# EAGLE design PowerMeter (EAGLE 9.3.0)
DATABASE: ../../../../digikeydb.txt
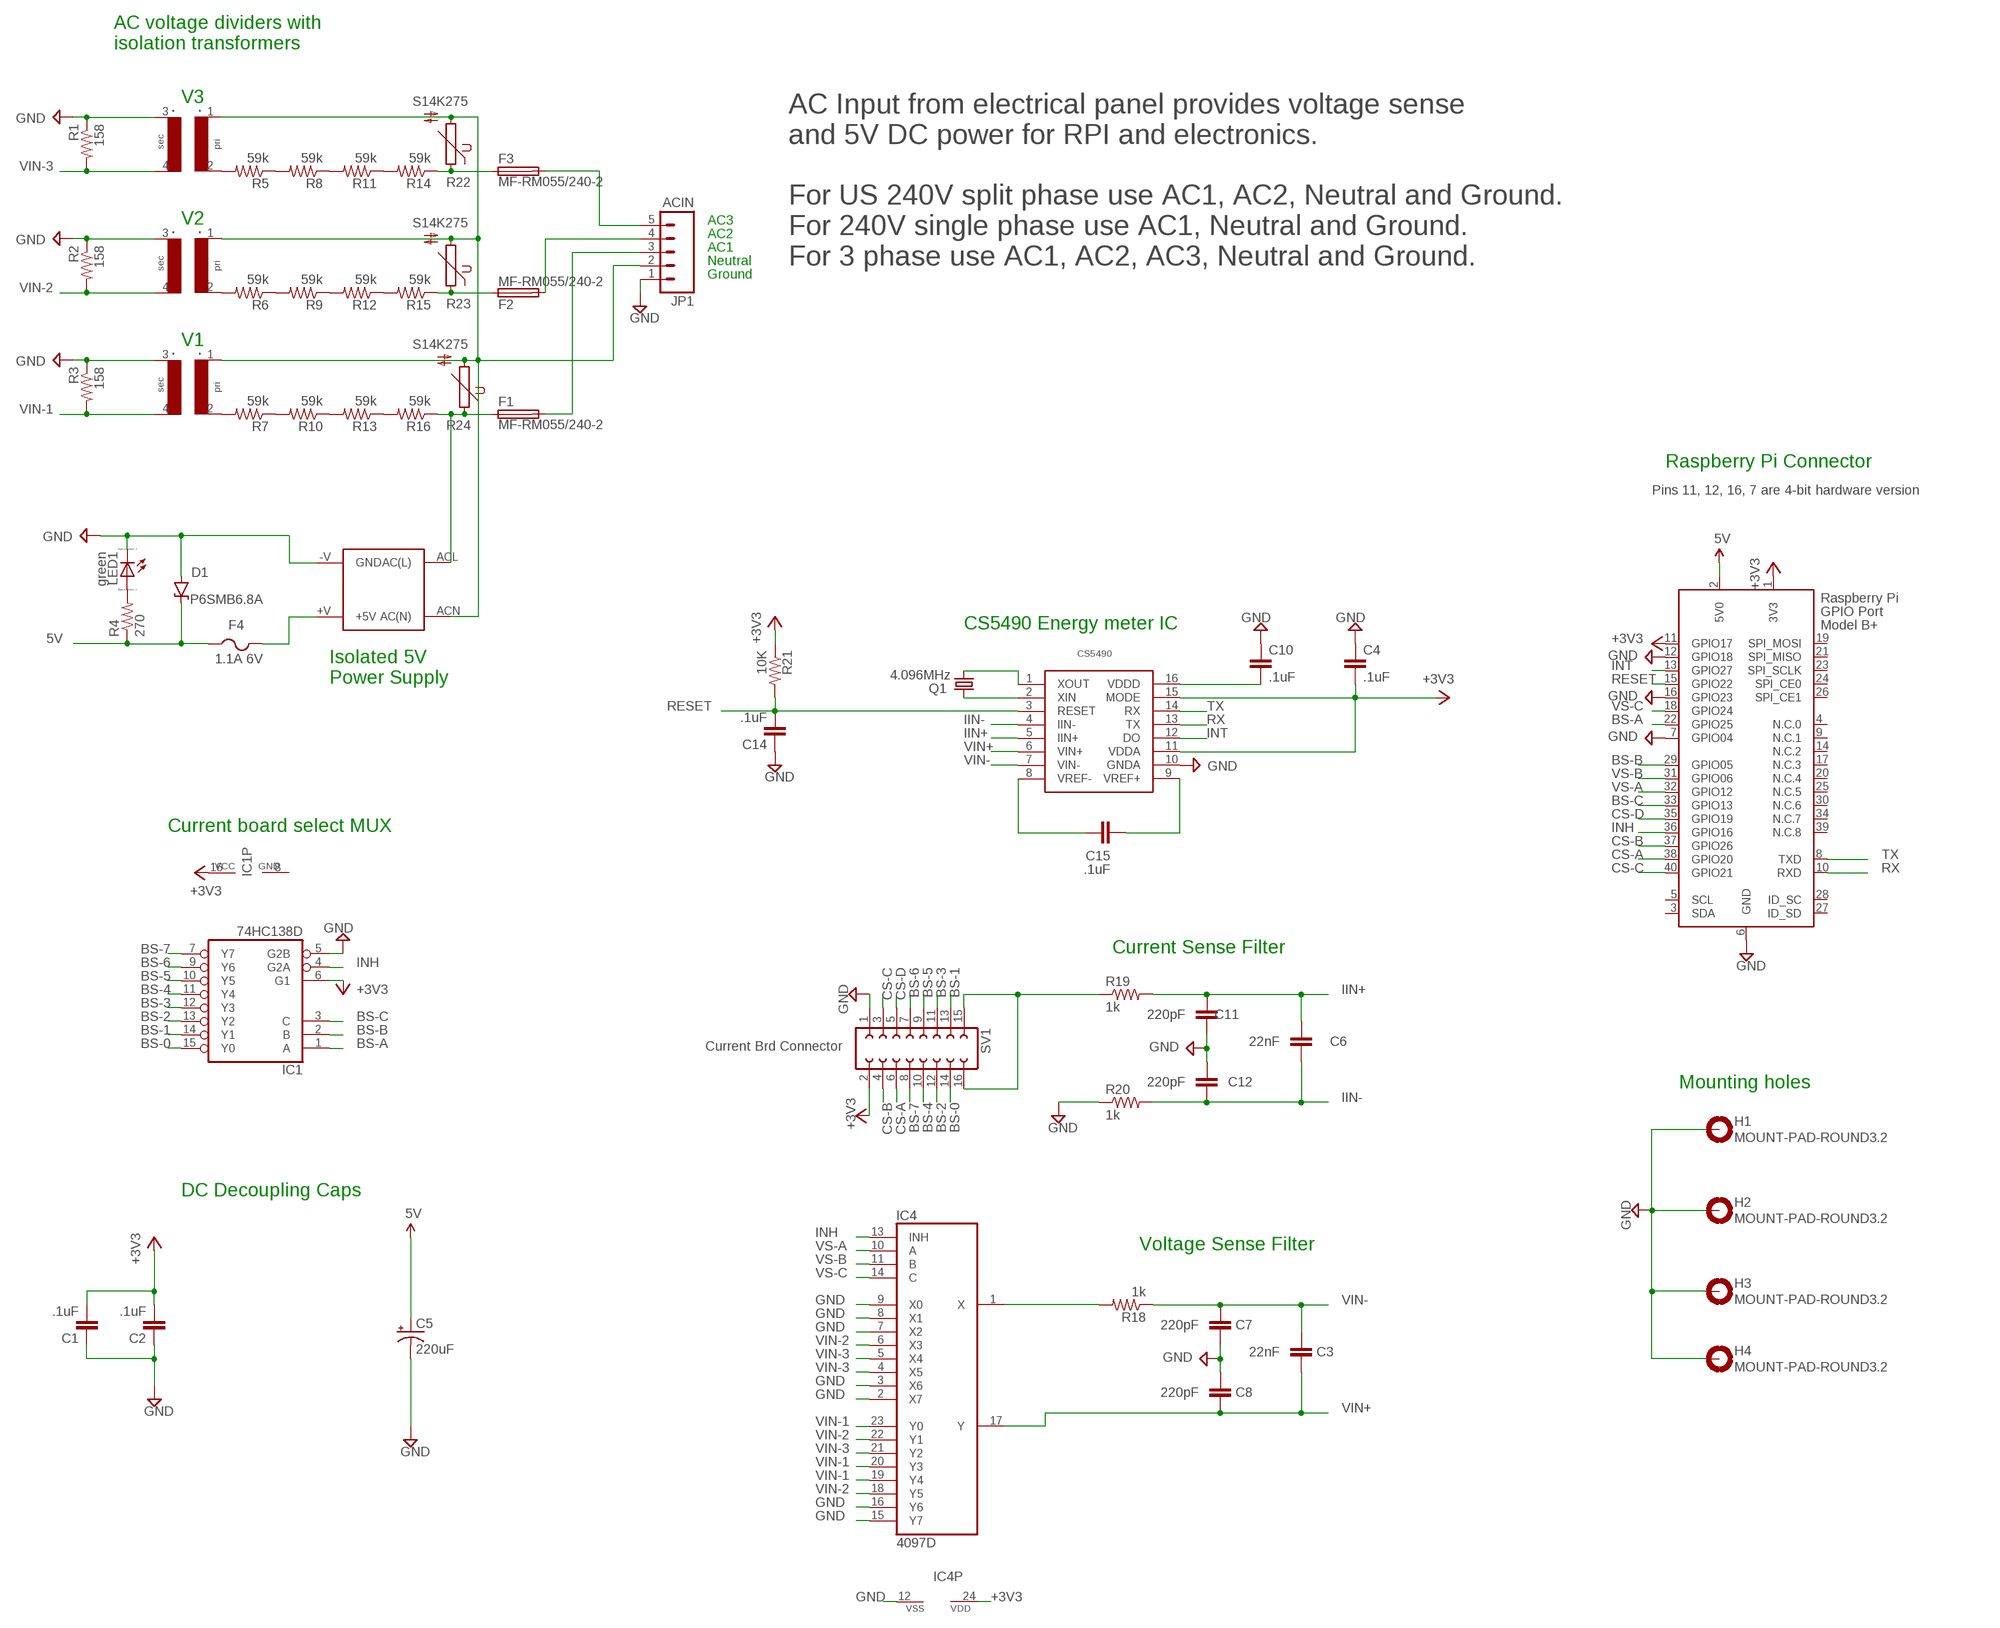
[diagram p0: schematic, sheet 1]

## Parts
C1  .1uF  C-EUC1206  [C1206]
C2  .1uF  C-EUC1206  [C1206]
C3  22nF  C-EUC1206  [C1206]
C4  .1uF  C-EUC1206  [C1206]
C5  220uF  CAP_POLD  [PANASONIC_D]
C6  22nF  C-EUC1206  [C1206]
C7  220pF  C-EUC1206  [C1206]
C8  220pF  C-EUC1206  [C1206]
C10  .1uF  C-EUC1206  [C1206]
C11  220pF  C-EUC1206  [C1206]
C12  220pF  C-EUC1206  [C1206]
C14  .1uF  C-EUC1206  [C1206]
C15  .1uF  C-EUC1206  [C1206]
CS5490  CS5490  [SOIC127P600X175-16N]
D1  P6SMB6.8A  DIODE-ZENER  [DO-214AA]
F1  MF-RM055/240-2  FUSETE5  [TE5]
F2  MF-RM055/240-2  FUSETE5  [TE5]
F3  MF-RM055/240-2  FUSETE5  [TE5]
F4  1.1A 6V  PTCFUSE-1812  [1812]
H1  MOUNT-PAD-ROUND3.2  [3,2-PAD]
H2  MOUNT-PAD-ROUND3.2  [3,2-PAD]
H3  MOUNT-PAD-ROUND3.2  [3,2-PAD]
H4  MOUNT-PAD-ROUND3.2  [3,2-PAD]
IC1  74HC138D  [SO16]
IC4  4097D  [SO24W]
JP1  ACIN  M05  [SCREWTERMINAL-5MM-5]
LED1  green  LED_E  [LED_1206]
Q1  4.096MHz  CRYSTALHC49UP  [HC49UP]
R1  158  R-US_R1206  [R1206]
R2  158  R-US_R1206  [R1206]
R3  158  R-US_R1206  [R1206]
R4  270  R-US_R1206  [R1206]
R5  59k  R-US_R1206  [R1206]
R6  59k  R-US_R1206  [R1206]
R7  59k  R-US_R1206  [R1206]
R8  59k  R-US_R1206  [R1206]
R9  59k  R-US_R1206  [R1206]
R10  59k  R-US_R1206  [R1206]
R11  59k  R-US_R1206  [R1206]
R12  59k  R-US_R1206  [R1206]
R13  59k  R-US_R1206  [R1206]
R14  59k  R-US_R1206  [R1206]
R15  59k  R-US_R1206  [R1206]
R16  59k  R-US_R1206  [R1206]
R18  1k  R-US_R1206  [R1206]
R19  1k  R-US_R1206  [R1206]
R20  1k  R-US_R1206  [R1206]
R21  10K  R-US_R1206  [R1206]
R22  S14K275  [S14K275]
R23  S14K275  [S14K275]
R24  S14K275  [S14K275]
SV1  Current Brd Connector  FE08-2  [FE08-2]
T1  TV16E  [TV16E]
T2  TV16E  [TV16E]
T3  TV16E  [TV16E]
U$1  IRM-10  [IRM-10]
X1  RASPI_BOARD_B+_E4  [RASPI_BOARD_B+_EDGES_4DRILL]

## Nets
5V: C5.+ D1.C F4.1 R4.1 X1.2(5V0)
+3V3: C1.2 C2.2 C4.2 CS5490.11(VDDA) CS5490.15(MODE) IC1.6(G1) IC1.16(VCC) IC4.24(VDD) R21.1 SV1.2 X1.1(3V3) X1.11(GPIO17)
+5V: F4.2 U$1.+V(+5V)
AC(L) [ac line]: F1.1 R16.1 R24.1 U$1.ACL(AC(L))
AC(N) [ac line]: JP1.2 R22.2 R23.2 R24.2 T1.1 T2.1 T3.1 U$1.ACN(AC(N))
BS-0: IC1.15(Y0) SV1.14
BS-1: IC1.14(Y1) SV1.13
BS-2: IC1.13(Y2) SV1.12
BS-3: IC1.12(Y3) SV1.11
BS-4: IC1.11(Y4) SV1.10
BS-5: IC1.10(Y5) SV1.9
BS-6: IC1.9(Y6) SV1.7
BS-7: IC1.7(Y7) SV1.8
BS-A: IC1.1(A) X1.22(GPIO25)
BS-B: IC1.2(B) X1.29(GPIO05)
BS-C: IC1.3(C) X1.33(GPIO13)
CS-A: SV1.6 X1.38(GPIO20)
CS-B: SV1.4 X1.37(GPIO26)
CS-C: SV1.3 X1.40(GPIO21)
CS-D: SV1.5 X1.35(GPIO19)
GND: C1.1 C2.1 C4.1 C5.- C7.1 C8.2 C10.1 C11.1 C12.2 C14.1 CS5490.10(GNDA) D1.A H1.B3,2(MOUNT) H2.B3,2(MOUNT) H3.B3,2(MOUNT) H4.B3,2(MOUNT) IC1.5(G2B) IC4.2(X7) IC4.3(X6) IC4.7(X2) IC4.8(X1) IC4.9(X0) IC4.12(VSS) IC4.15(Y7) IC4.16(Y6) JP1.1 LED1.C R1.1 R2.1 R3.1 R20.1 SV1.1 T1.3 T2.3 T3.3 U$1.-V(GND) X1.6(GND) X1.7(GPIO04) X1.12(GPIO18) X1.16(GPIO23)
IIN+: C6.2 C11.2 CS5490.5(IIN+) R19.2
IIN-: C6.1 C12.1 CS5490.4(IIN-) R20.2
INH: IC1.4(G2A) IC4.13(INH) X1.36(GPIO16)
INT: CS5490.12(DO) X1.13(GPIO27)
N$1: CS5490.2(XIN) Q1.1
N$2 [ac line]: F2.1 R15.1 R23.1
N$3 [ac line]: R5.1 R8.2
N$4 [ac line]: R8.1 R11.2
N$5 [ac line]: F1.2 JP1.3
N$6 [ac line]: R9.1 R12.2
N$7: LED1.A R4.2
N$8: IC4.1(X) R18.2
N$9 [ac line]: F3.2 JP1.5
N$10 [ac line]: R13.1 R16.2
N$11 [ac line]: R7.2 T3.2
N$12: CS5490.1(XOUT) Q1.2
N$13 [ac line]: R7.1 R10.2
N$14 [ac line]: R10.1 R13.2
N$15 [ac line]: R6.2 T2.2
N$16 [ac line]: R6.1 R9.2
N$17: C10.2 CS5490.16(VDDD)
N$18 [ac line]: R12.1 R15.2
N$19 [ac line]: R5.2 T1.2
N$20 [ac line]: R11.1 R14.2
N$22 [ac line]: F3.1 R14.1 R22.1
N$23: R19.1 SV1.15 SV1.16
N$24: C15.1 CS5490.8(VREF-)
N$25: C15.2 CS5490.9(VREF+)
N$38 [ac line]: F2.2 JP1.4
RESET: C14.2 CS5490.3(RESET) R21.2 X1.15(GPIO22)
RX: CS5490.13(TX) X1.10(RXD)
TX: CS5490.14(RX) X1.8(TXD)
VIN+: C3.1 C8.1 CS5490.6(VIN+) IC4.17(Y)
VIN-: C3.2 C7.2 CS5490.7(VIN-) R18.1
VIN-1: IC4.19(Y4) IC4.20(Y3) IC4.23(Y0) R3.2 T3.4
VIN-2: IC4.6(X3) IC4.18(Y5) IC4.22(Y1) R2.2 T2.4
VIN-3: IC4.4(X5) IC4.5(X4) IC4.21(Y2) R1.2 T1.4
VS-A: IC4.10(A) X1.32(GPIO12)
VS-B: IC4.11(B) X1.31(GPIO06)
VS-C: IC4.14(C) X1.18(GPIO24)
Unconnected: X1.3(SDA) X1.4(N.C.0) X1.5(SCL) X1.9(N.C.1) X1.14(N.C.2) X1.17(N.C.3) X1.19(SPI_MOSI) X1.20(N.C.4) X1.21(SPI_MISO) X1.23(SPI_SCLK) X1.24(SPI_CE0) X1.25(N.C.5) X1.26(SPI_CE1) X1.27(ID_SD) X1.28(ID_SC) X1.30(N.C.6) X1.34(N.C.7) X1.39(N.C.8)

## Notes on the sheet
- AC voltage dividers with
  isolation transformers
- V3
- V2 | AC3
- AC2
- AC1
- Neutral
- AC Input from electrical panel provides voltage sense 
  and 5V DC power for RPI and electronics.
  
  For US 240V split phase use AC1, AC2, Neutral and Ground.
  For 240V single phase use AC1, Neutral and Ground.
  For 3 phase use AC1, AC2, AC3, Neutral and Ground.
- Ground
- V1
- Raspberry Pi Connector
- Pins 11, 12, 16, 7 are 4-bit hardware version
- CS5490 Energy meter IC
- Isolated 5V
  Power Supply
- Current board select MUX
- Current Sense Filter
- Mounting holes
- DC Decoupling Caps
- Voltage Sense Filter

## Power pins joined to a net without a drawn wire
GND: IC1.8(GND)

## Library data of the parts
C1 C2 C4 C10 C14 C15 = rcl:C-EU: CAPACITOR, European symbol; PARTNO: C1206C104K5RAC7867
C3 C6-C8 C11 C12 = rcl:C-EU: CAPACITOR, European symbol; PARTNO: C1206C221J5GACTU
C5 = SparkFun-Capacitors:CAP_POL: Capacitor Polarized These are standard SMD and PTH capacitors. Normally 10uF, 47uF, and 100uF in electrolytic and tantalum varieties. Always verify the external diameter of the through hole cap, it varies with capacity, voltage, and manufacturer. The EIA devices should be standard.; PARTNO: ESH227M016AE3AA
CS5490 = Cirrus_Logic_By_element14_Batch_1:CS5490
D1 = SparkFun-DiscreteSemi:DIODE-ZENER: Zener Diode Production Part - 8199 3.4V Zener Voltage; PARTNO: P6KE6.8A
F1-F3 = fuse:FUSE: Fuse; OC_FARNELL: unknown; OC_NEWARK: unknown; PARTNO: MF-RM055/240-2
F4 = adafruit:PTCFUSE: PTC fuses, resettable thermistors; PARTNO: 0ZCC0110AF2C
H1-H4 = holes:MOUNT-PAD-ROUND: MOUNTING PAD, round; BOM: EXCLUDE
IC1 = 74xx-eu:74*138: 3-line to 8-line DECODER/DEMULTIPLEXER; PARTNO: SN74HC138NSR
IC4 = 40xx:4097: Dual 8-channel ANALOG MULTIPLEXER
JP1 = SparkFun-Connectors:M05: Header 5 Standard 5-pin 0.1" header. Use with straight break away headers (SKU : PRT-00116), right angle break away headers (PRT-00553), swiss pins (PRT-00743), machine pins (PRT-00117), and female headers (PRT-00115). Molex polarized connector foot print use with SKU : PRT-08230 with associated crimp pins and housings.; PARTNO: 1935190
LED1 = eagle-ltspice:LED_E: LED Source: http://www.osram.convergy.de Source: www.luxeon.com Source: www.kingbright.com; PARTNO: LTST-C150GKT; SPICEMODEL: NONE; SPICEPREFIX: D; SPICETYPE: diode
Q1 = adafruit:CRYSTAL: CRYSTAL; OC_FARNELL: unknown; OC_NEWARK: unknown; PARTNO: 9B-4.096MBBK-B
R1-R3 = resistor:R-US_: RESISTOR, American symbol; PARTNO: RC1206FR-07158RL
R4 = resistor:R-US_: RESISTOR, American symbol; PARTNO: RC1206FR-07270RL
R5-R16 R18-R20 = resistor:R-US_: RESISTOR, American symbol; PARTNO: RC1206FR-071KL
R21 = resistor:R-US_: RESISTOR, American symbol; PARTNO: RC1206FR-0710KL
R22-R24 = varistor:S14K275: VARISTOR
SV1 = con-lsta:FE08-2: FEMALE HEADER; OC_FARNELL: unknown; OC_NEWARK: unknown; PARTNO: PPTC082LFBN-RC
T1-T3 = CraigJensen:TV16E: YHDC TV16E Transformer
U$1 = CraigJensen:IRM-10
X1 = raspberrypi_bastelstube_v13:RASPI_BOARD_B+: Raspberry Pi GPIO connector with markings for the outer dimensions of the Raspberry Pi board model B+ with different sets of drill holes or mounting pads; PARTNO: M20-9762046

## Net classes
1 ac line: width 0.4 mm, clearance 1.2 mm

## Board
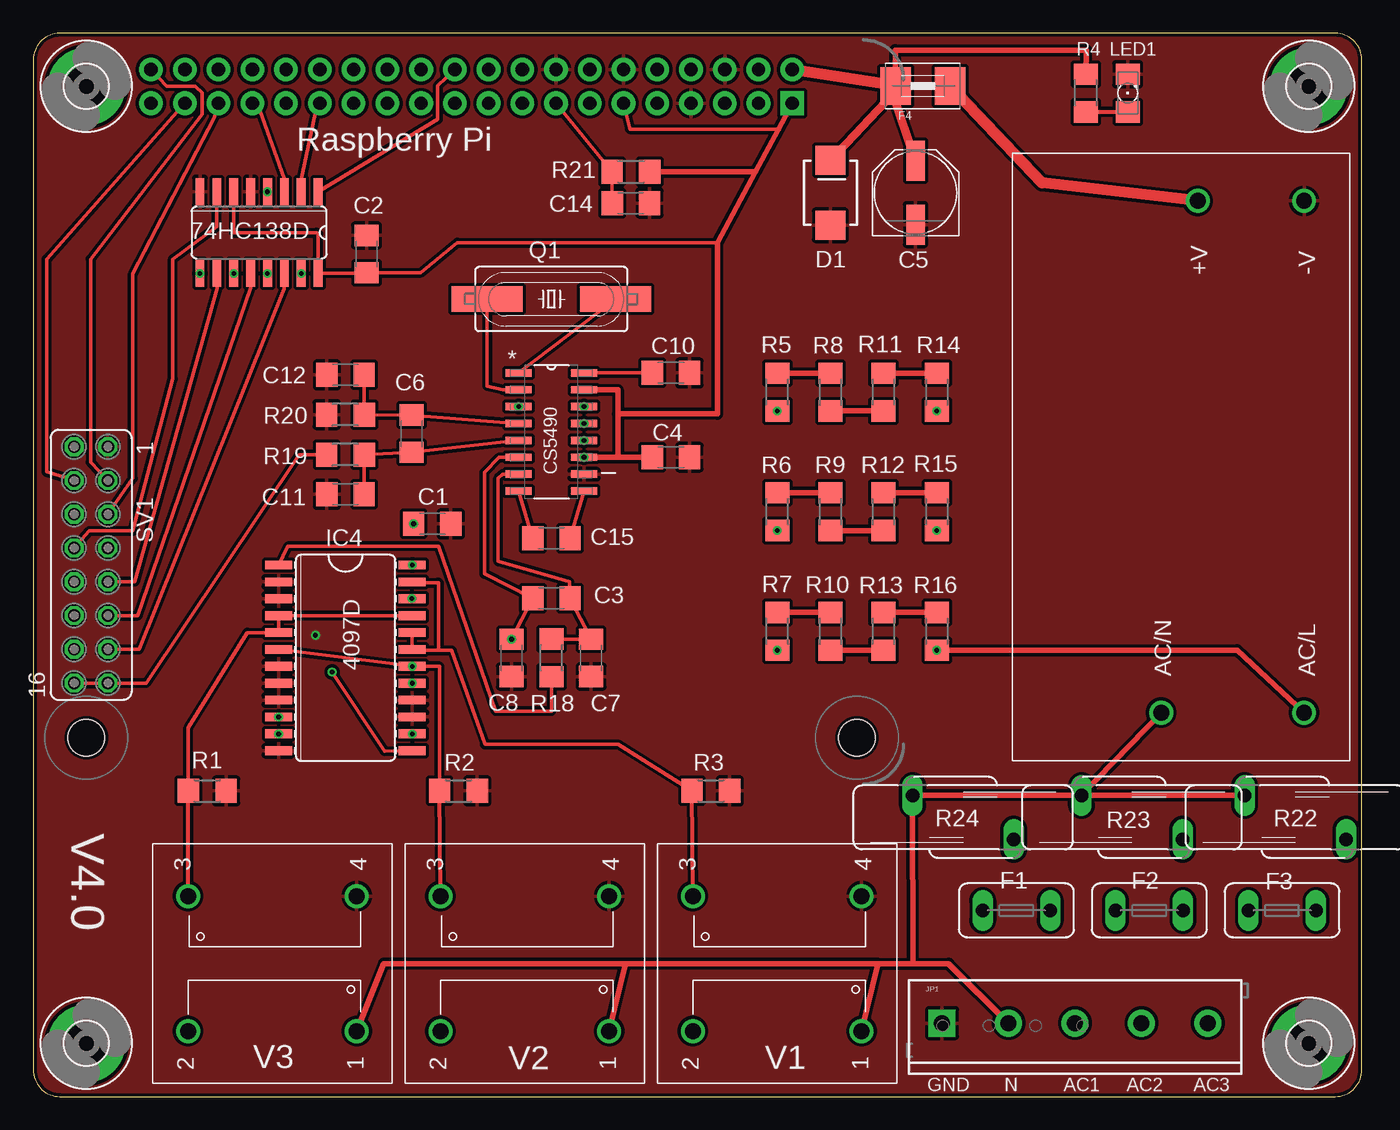
[diagram p1: board, top side]
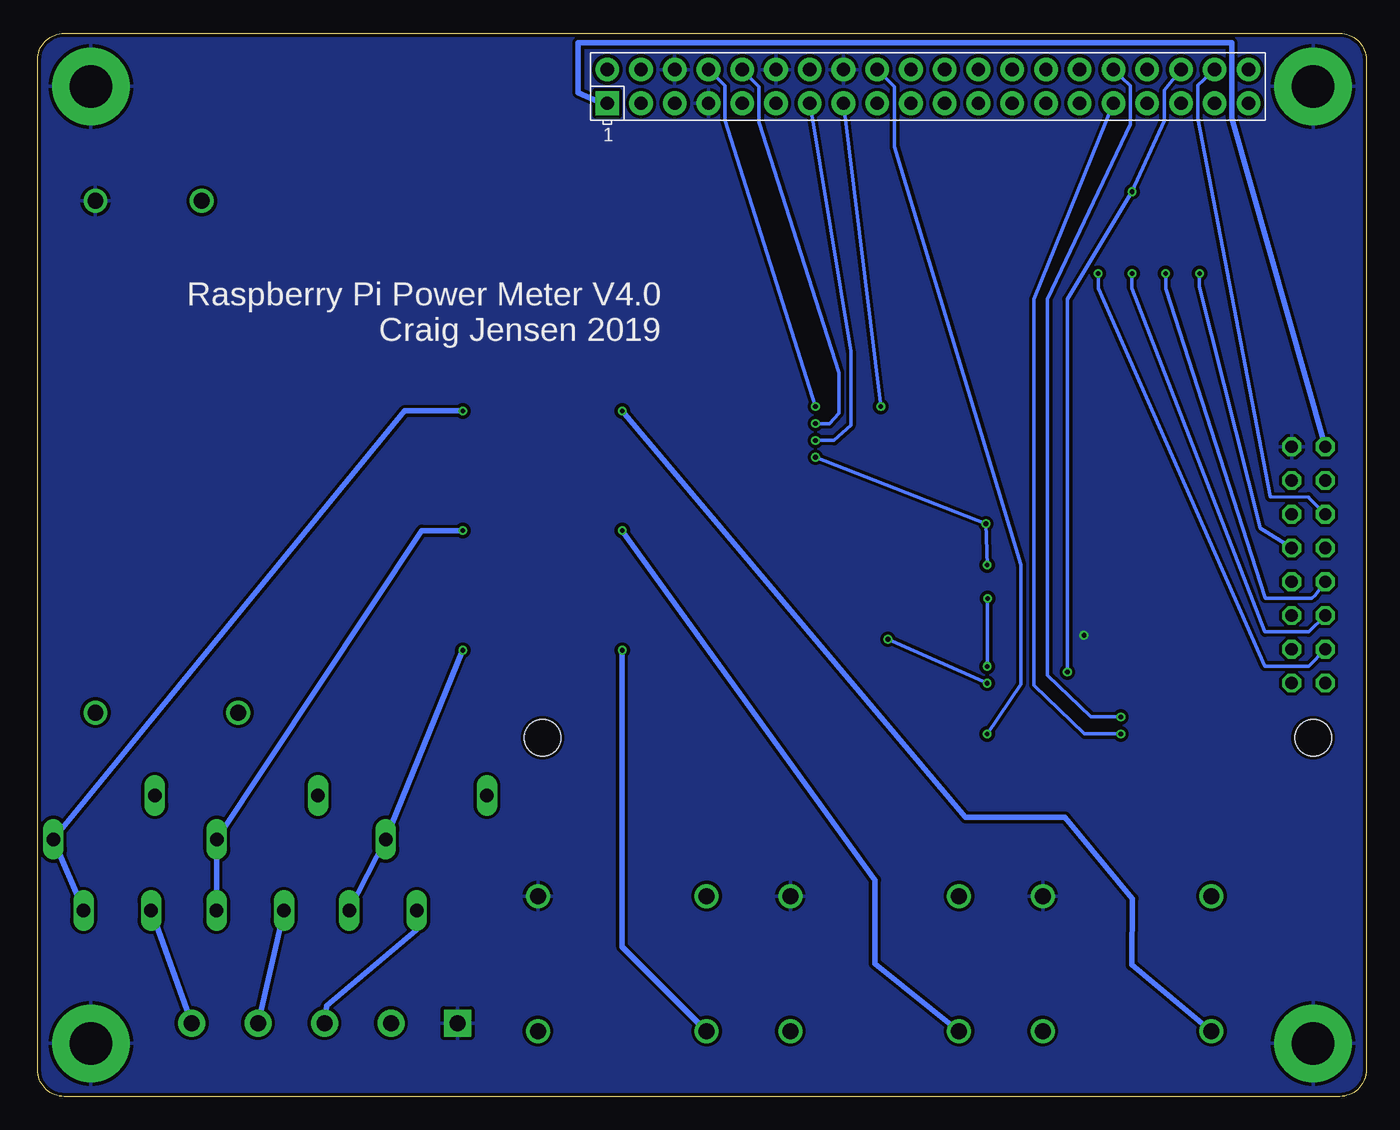
[diagram p2: board, bottom side, seen from below]

Size 100 x 80 mm. Coordinates in mm from the lower left corner, seen from the top.
Outline: 98,80 2,80 arc90 0,78 0,2 arc90 2,0 98,0 arc90 100,2 100,78 arc90 98,80
Copper layers (1*16): Top 0.035mm / dielectric 1.5mm / Bottom 0.035mm
Design rules "Elecrow_2-layer_eagle_rule": minimum track width 6mil, minimum drill 12mil, track to track 6mil, track to pad 6mil, pad to pad 6mil, via to via 6mil, smd to smd 0mil, copper to edge 10mil, drill to drill 10mil, minimum pad ring 10mil, minimum via ring 6mil, stop-mask expansion 2mil, vias tented up to drill 100mil, thermal gap 10mil

### Footprints (pad centres in the part's own frame; a part is rotated, then mirrored left to right if it is on the bottom)
C1206 = smd 1.6 x 1.8: 1 -1.4,0; 2 1.4,0
PANASONIC_D = smd 3 x 1.4: + 2.4,0; - -2.4,0
SOIC127P600X175-16N = smd 1.981 x 0.559: 1 -2.464,4.445; 2 -2.464,3.175; 3 -2.464,1.905; 4 -2.464,0.635; 5 -2.464,-0.635; 6 -2.464,-1.905; 7 -2.464,-3.175; 8 -2.464,-4.445; 9 2.464,-4.445; 10 2.464,-3.175; 11 2.464,-1.905; 12 2.464,-0.635; 13 2.464,0.635; 14 2.464,1.905; 15 2.464,3.175; 16 2.464,4.445
DO-214AA = smd 2.16 x 2.26: A -2.45,0; C 2.45,0
TE5 = drill 1.016 long: 1 -2.54,0; 2 2.54,0
1812 = smd 2.286 x 2.794: 1 -2.046,0; 2 2.046,0
3,2-PAD = drill 3.2 pad 5.842: B3,2 0,0
SO16 = smd 0.66 x 2.032: 1 -4.445,-3.073; 2 -3.175,-3.073; 3 -1.905,-3.073; 4 -0.635,-3.073; 5 0.635,-3.073; 6 1.905,-3.073; 7 3.175,-3.073; 8 4.445,-3.073; 9 4.445,3.073; 10 3.175,3.073; 11 1.905,3.073; 12 0.635,3.073; 13 -0.635,3.073; 14 -1.905,3.073; 15 -3.175,3.073; 16 -4.445,3.073
SO24W = smd 0.66 x 2.032: 1 -6.985,-5.029; 2 -5.715,-5.029; 3 -4.445,-5.029; 4 -3.175,-5.029; 5 -1.905,-5.029; 6 -0.635,-5.029; 7 0.635,-5.029; 8 1.905,-5.029; 9 3.175,-5.029; 10 4.445,-5.029; 11 5.715,-5.029; 12 6.985,-5.029; 13 6.985,5.029; 14 5.715,5.029; 15 4.445,5.029; 16 3.175,5.029; 17 1.905,5.029; 18 0.635,5.029; 19 -0.635,5.029; 20 -1.905,5.029; 21 -3.175,5.029; 22 -4.445,5.029; 23 -5.715,5.029; 24 -6.985,5.029
SCREWTERMINAL-5MM-5 = drill 1.2 pad 2.032 square: 1 2.53,4.46 | drill 1.2 pad 2.032: 2 7.53,4.46; 3 12.53,4.46; 4 17.53,4.46; 5 22.53,4.46
LED_1206 = smd 1.6 x 1.803: A -1.422,0; C 1.422,0
HC49UP = smd 5.334 x 1.93: 1 -4.826,0; 2 4.826,0
R1206 = smd 1.6 x 1.803: 1 -1.422,0; 2 1.422,0
S14K275 = drill 1.016 long: 1 -1.651,-3.81; 2 1.651,3.81
FE08-2 = drill 0.914 octagon: 1 -8.89,1.27; 2 -8.89,-1.27; 3 -6.35,1.27; 4 -6.35,-1.27; 5 -3.81,1.27; 6 -3.81,-1.27; 7 -1.27,1.27; 8 -1.27,-1.27; 9 1.27,1.27; 10 1.27,-1.27; 11 3.81,1.27; 12 3.81,-1.27; 13 6.35,1.27; 14 6.35,-1.27; 15 8.89,1.27; 16 8.89,-1.27
TV16E = drill 1.2: 1 -5.08,-6.35; 2 -5.08,6.35; 3 5.08,-6.35; 4 5.08,6.35
IRM-10 = drill 1.2: +V 19.25,-1.25; -V 19.25,-9.25; ACL -19.25,-9.25; ACN -19.25,1.5
RASPI_BOARD_B+_EDGES_4DRILL = drill 1 pad 1.778 square: 1 8.37,51.23 | drill 1 pad 1.778: 2 8.37,53.77; 3 10.91,51.23; 4 10.91,53.77; 5 13.45,51.23; 6 13.45,53.77; 7 15.99,51.23; 8 15.99,53.77; 9 18.53,51.23; 10 18.53,53.77; 11 21.07,51.23; 12 21.07,53.77; 13 23.61,51.23; 14 23.61,53.77; 15 26.15,51.23; 16 26.15,53.77; 17 28.69,51.23; 18 28.69,53.77; 19 31.23,51.23; 20 31.23,53.77; 21 33.77,51.23; 22 33.77,53.77; 23 36.31,51.23; 24 36.31,53.77; 25 38.85,51.23; 26 38.85,53.77; 27 41.39,51.23; 28 41.39,53.77; 29 43.93,51.23; 30 43.93,53.77; 31 46.47,51.23; 32 46.47,53.77; 33 49.01,51.23; 34 49.01,53.77; 35 51.55,51.23; 36 51.55,53.77; 37 54.09,51.23; 38 54.09,53.77; 39 56.63,51.23; 40 56.63,53.77 | hole 2.75: 61.5,3.5; 3.5,3.5

### Placement (x,y rotation side)
C1  30.03,43.09 180 top
C2  25.08,63.38 270 top
C3  39,37.5 0 top
C4  48,48.1 180 top
C5  66.41,68 90 top
C6  28.47,49.87 270 top
C7  42,33 90 top
C8  36,33 270 top
C10  48,54.44 180 top
C11  23.5,45.3 0 top
C12  23.5,54.3 180 top
C14  44.98,67.22 180 top
C15  39,42 0 top
CS5490  39,50 0 top
D1  60,68 90 top
F1  74,14 180 top
F2  84,14 180 top
F3  94,14 180 top
F4  66.96,76.03 0 top
H1  96,76 0 top
H2  96,4 0 top
H3  4,4 0 top
H4  4,76 0 top
IC1  17,65 180 top
IC4  23.5,33 270 top
JP1  65.88,1.06 0 top
LED1  82.38,75.5 90 top
Q1  39,60 0 top
R1  13.1,23 180 top
R2  32,23 180 top
R3  51,23 180 top
R4  79.23,75.5 270 top
R5  56,53 270 top
R6  56,44 270 top
R7  56,35 270 top
R8  60,53 90 top
R9  60,44 90 top
R10  60,35 90 top
R11  64,53 270 top
R12  64,44 270 top
R13  64,35 270 top
R14  68,53 90 top
R15  68,44 90 top
R16  68,35 90 top
R18  39,33 270 top
R19  23.5,48.3 0 top
R20  23.5,51.3 0 top
R21  44.99,69.58 180 top
R22  95,21 90 top
R23  82.7,21 90 top
R24  70,21 90 top
SV1  4.35,40 270 top
T1  18,10 90 top
T2  37,10 90 top
T3  56,10 90 top
U$1  86.4,48.13 90 top
X1  65.5,23.5 0 bottom

### Tracks (layer width: path | path; a pad name or v marks a point on that pad's centre or on a via)
5V
  Top 0.406: R4.1 79.25,78.73 64.89,78.73 F4.1
  Top 0.61: F4.1 64.69,75.44 | 64.69,75.44 D1.C | C5.+ 64.69,75.44
  Top 0.813: F4.1 X1.2
+3V3  (via drill 0.35)
  Top 0.254: IC1.6 15.1,65 21.32,65 21.45,64.88 IC1.16 25.02,61.93 C2.2 29.18,61.98 31.91,64.25 51.5,64.25 | X1.11 44.91,72.79 56.09,72.77
  Top 0.406: 44,48.1 C4.2 | 44,51.36 51.5,51.36 51.5,64.25 54.38,69.58 | 44,51.36 44,48.1 | X1.1 56.09,72.77 54.38,69.58 | R21.1 54.38,69.58 | CS5490.15 44,53.17 44,51.36 | CS5490.11 44,48.09 44,48.1
  Bottom 0.254: IC4.24 C1.2 CS5490.11
  Bottom 0.406: X1.1 57.51,74.73 59.32,75.53 59.33,79.28 10.14,79.28 10.14,73.62 SV1.2
  other vias: 41.46,48.09 28.53,39.98 28.63,43.09
+5V
  Top 0.813: U$1.+V 75.92,68.74 F4.2
AC(L)  (via drill 0.35)
  Top 0.4: R16.1 90.62,33.58 U$1.ACL
  Bottom 0.4: F1.1 R24.1 R16.1
  other vias: 68,33.58
AC(N)
  Top 0.4: U$1.ACN R23.2 | R23.2 R22.2 | R23.2 R24.2 66.2,10 | 63.56,10 66.2,10 | 66.2,10 68.89,10 JP1.2
  Top 0.406: 44.58,10 63.56,10 T3.1 | 44.58,10 26.38,10 T1.1 | T2.1 44.58,10
BS-0  (via drill 0.35)
  Bottom 0.254: SV1.14 4.34,32.38 7.65,32.38 20.16,60.82 20.16,61.91 IC1.15
  other vias: 20.18,61.93
BS-1
  Top 0.254: SV1.13 7.96,33.65 18.91,60.78 IC1.14
BS-2  (via drill 0.35)
  Bottom 0.254: SV1.12 4.33,34.95 7.63,34.95 17.64,60.8 IC1.13
  other vias: 17.64,61.93
BS-3
  Top 0.254: SV1.11 7.87,36.19 16.36,60.85 IC1.12
BS-4  (via drill 0.35)
  Bottom 0.254: SV1.10 3.85,37.71 4.11,37.5 7.61,37.5 15.1,60.78 IC1.11
  other vias: 15.1,61.93
BS-5
  Top 0.254: IC1.10 13.86,61.9 13.86,60.82 7.64,38.73 SV1.9
BS-6  (via drill 0.35)
  Bottom 0.254: SV1.7 7.97,42.76 12.55,60.93 IC1.9
  other vias: 12.55,61.93
BS-7
  Top 0.254: IC1.7 13.82,65.45 10.5,63 10.5,54 7.5,42.55 4.23,42.55 SV1.8
BS-A
  Top 0.254: X1.22 30.45,76.04 30.45,73.52 IC1.1
BS-B
  Top 0.254: X1.29 21.33,74.49 20.18,68.99 IC1.2
BS-C
  Top 0.254: IC1.3 18.91,69.1 17.08,74.14 X1.33
CS-A
  Bottom 0.254: SV1.6 4.36,45.09 4.34,45.11 7.23,45.12 12.68,73.59 12.68,76.1 X1.38
CS-B
  Top 0.254: SV1.4 1,47 1,63 X1.37
CS-C
  Top 0.254: X1.40 10.06,76 12.19,76 12.7,75.51 12.7,73.92 4.32,63 4.32,47.73 SV1.3
CS-D
  Top 0.254: SV1.5 7.49,46.51 7.49,61.89 13.63,73.65 X1.35
GND  (via drill 0.35)
  other vias: 21.25,34.71
  pour Bottom (isolate 0.25): 101.38,81.12 101.86,-1 -1.12,-0.88 -1,34 -0.88,81.12
  pour Top (isolate 0.25): 101.38,81.25 101.31,-1 -2,-0.75 -2,81.25
IIN+
  Top 0.254: C11.2 R19.2 C6.2 CS5490.5
IIN-
  Top 0.254: C12.1 R20.2 C6.1 CS5490.4
INH  (via drill 0.35)
  Top 0.254: v22.5,31.93 26.44,25.98 IC4.13
  Bottom 0.254: X1.36 15.2,75.7 15.2,73.42 IC1.4 22.5,60 v22.5,31.93
  other vias: 17.64,68.07
INT  (via drill 0.35)
  Bottom 0.254: X1.13 38.8,56.08 38.8,50.5 40.06,49.37 CS5490.12
  other vias: 41.46,49.37
N$1
  Top 0.254: Q1.1 34.17,53.46 35.35,53.17 CS5490.2
N$2  (via drill 0.35)
  Bottom 0.4: F2.1 R23.1 71.1,42.58 R15.1
  other vias: 68,42.58
N$3
  Top 0.406: R5.1 R8.2
N$4
  Top 0.406: R8.1 R11.2
N$5
  Bottom 0.406: JP1.3 78.24,6.81 71.53,12.51 F1.2
N$6
  Top 0.406: R12.2 R9.1
N$7
  Top 0.305: R4.2 LED1.A
N$8
  Top 0.254: R18.2 39,29 34.8,29 30.5,41.4 19.16,41.4 IC4.1
N$9
  Bottom 0.406: JP1.5 F3.2
N$10
  Top 0.406: R13.1 R16.2
N$11  (via drill 0.35)
  Bottom 0.406: T3.2 56,11.25 R7.2
  other vias: 56,33.58
N$12
  Top 0.254: Q1.2 CS5490.1
N$13
  Top 0.406: R7.1 R10.2
N$14
  Top 0.406: R10.1 R13.2
N$15  (via drill 0.35)
  Bottom 0.406: T2.2 37,10 36.97,16.28 R6.2
  other vias: 56,42.58
N$16
  Top 0.406: R9.2 R6.1
N$17
  Top 0.254: CS5490.16 C10.2
N$18
  Top 0.406: R15.2 R12.1
N$19  (via drill 0.35)
  Bottom 0.406: T1.2 17.66,9.9 17.61,14.9 22.67,21 30.16,21 R5.2
  other vias: 56,51.58
N$20
  Top 0.406: R11.1 R14.2
N$22  (via drill 0.35)
  Bottom 0.4: F3.1 R22.1 72.38,51.58 R14.1
  other vias: 68,51.58
N$23
  Top 0.254: SV1.16 SV1.15 8.5,31.11 20,48.3 R19.1
N$24
  Top 0.254: CS5490.8 C15.1
N$25
  Top 0.254: CS5490.9 C15.2
N$38
  Bottom 0.406: JP1.4 F2.2
RESET  (via drill 0.35)
  Top 0.254: C14.2 43.57,67.23 R21.2 X1.15
  Bottom 0.254: CS5490.3 X1.15
  other vias: 36.54,51.91
RX  (via drill 0.35)
  Bottom 0.254: X1.10 45.7,75.96 45.7,73.31 39.7,54.45 39.7,51.39 40.4,50.63 CS5490.13
  other vias: 41.46,50.63
TX  (via drill 0.35)
  Bottom 0.254: X1.8 48.25,76.03 48.25,73.46 CS5490.14
  other vias: 41.46,51.91
VIN+  (via drill 0.35)
  Top 0.254: C8.1 C3.1 33.96,39.33 33.96,46.96 35.07,48.09 CS5490.6
  Bottom 0.254: IC4.17 C8.1
  other vias: 28.53,31.09 36,34.4
VIN-
  Top 0.254: CS5490.7 36.17,46.83 35.33,46.83 35,46.5 35,40.27 40.36,38.72 C3.2 C7.2 R18.1
VIN-1
  Top 0.254: IC4.20 IC4.19 28.59,33.57 30.52,33.57 | 30.52,33.57 31.5,33.57 34,26.5 44,26.5 R3.2 | IC4.23 28.57,38.67 30.46,38.67 arc-90 30.52,38.61 30.52,33.57
  Top 0.305: T3.4 R3.2
VIN-2  (via drill 0.35)
  Top 0.254: 28.61,32.37 30.58,32.37 R2.2 | 28.61,32.37 IC4.18 | IC4.22 arc90 v28.5,37.47 | IC4.6 28.61,32.37
  Top 0.305: T2.4 R2.2
  Bottom 0.254: v28.5,37.47 IC4.22 IC4.18
  other vias: 28.53,32.37
VIN-3
  Top 0.254: IC4.21 IC4.4 IC4.5 16.11,34.91 11.68,27.74 R1.2
  Top 0.305: T1.4 R1.2
VS-A  (via drill 0.35)
  Bottom 0.254: X1.32 17.75,76.04 17.75,73.14 24,60 24,31.68 20.73,28.56 IC4.10
  other vias: 18.47,28.55
VS-B  (via drill 0.35)
  Bottom 0.254: X1.31 25,60 25,30.96 21.21,27.29 IC4.11
  other vias: 18.47,27.29
VS-C  (via drill 0.35)
  Bottom 0.254: X1.18 36.79,77.27 35.51,75.99 35.51,71.45 26,40 26,31 IC4.14
  other vias: 28.53,27.29

### Text on the board
tNames: Raspberry Pi | V4.0 | V3 | V2 | V1 | GND | N | AC1 | AC2 | AC3
bNames: Raspberry Pi Power Meter V4.0 / Craig Jensen 2019